# Altium schematic sheet GPS.SchDoc
size A
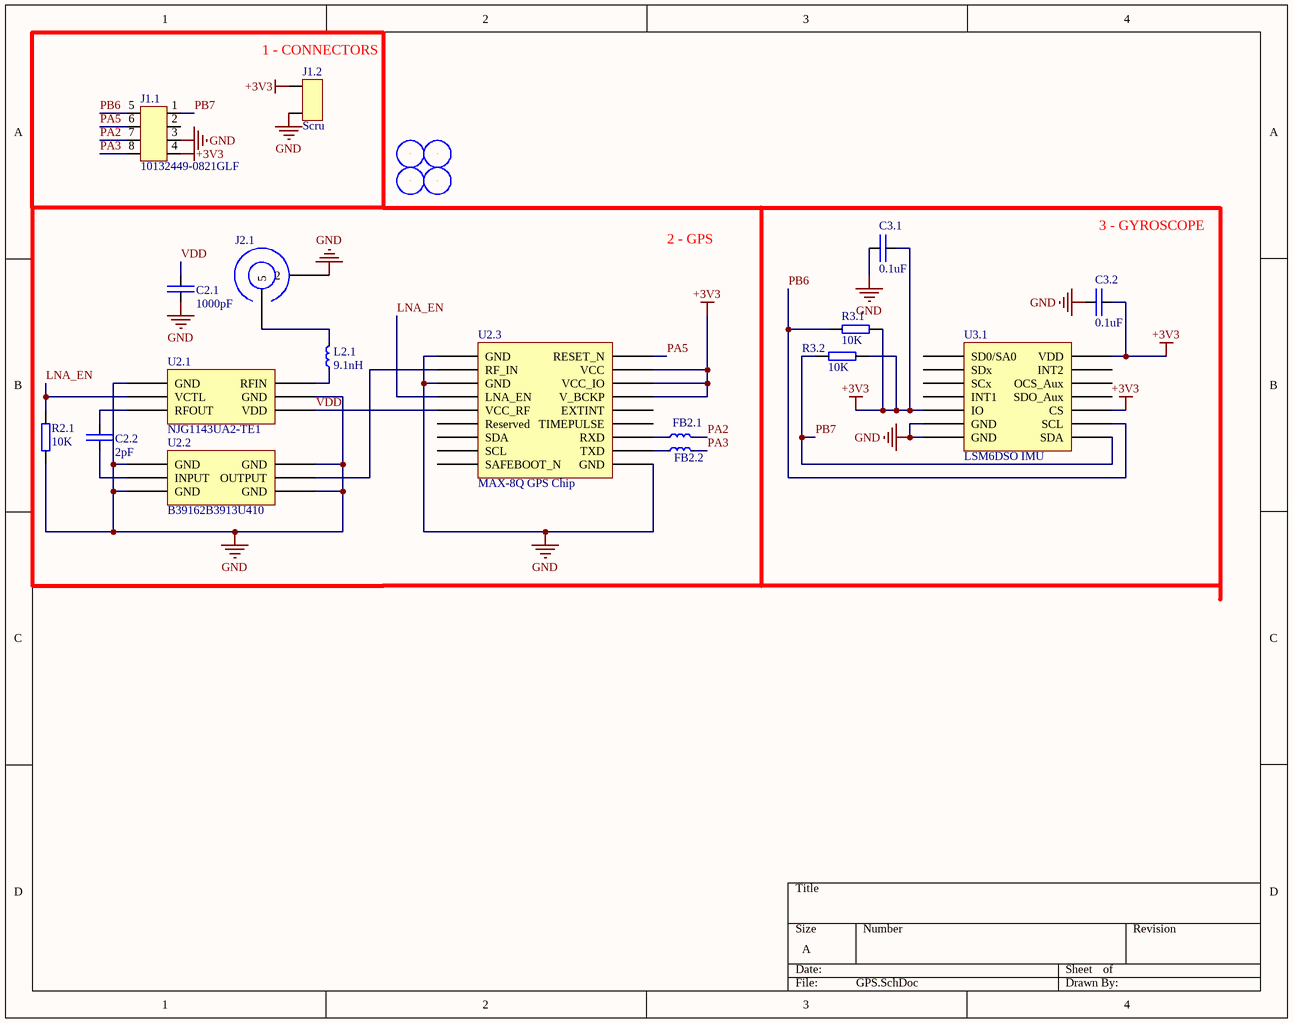
[diagram p0: GPS.SchDoc]

## Parts
(Parts that share a designator on the sheet are numbered #1, #2 ... from top to bottom, then left to right.)
?#1  3mm Mounting Hole  [3mm Mounting Hole]  (value not drawn)
?#2  3mm Mounting Hole  [3mm Mounting Hole]  (value not drawn)
?#3  3mm Mounting Hole  [3mm Mounting Hole]  (value not drawn)
?#4  3mm Mounting Hole  [3mm Mounting Hole]  (value not drawn)
C2.1  1000pF  [0805]
C2.2  2pF  [0805]
C3.1  0.1uF  [C0805]
C3.2  0.1uF  [C0805]
FB2.1  BLM15HD102SN1D  [L0402]  (value not drawn)
FB2.2  BLM15HD102SN1D  [L0402]  (value not drawn)
J1.1  10132449-0821GLF  [Micro-Fit 3.0 8pos]
J1.2  Scru  [5mm 2POS Screw terminal]
J2.1  132136  [132136]  (value not drawn)
L2.1  9.1nH  [0402]
R2.1  10K  [R0805]
R3.1  10K  [R0805]
R3.2  10K  [R0805]
U2.1  NJG1143UA2-TE1  [EPFFP6-A2]
U2.2  B39162B3913U410  [DCC6C]
U2.3  MAX-8Q GPS Chip  [MAX-8Q GPS]
U3.1  LSM6DSO IMU  [LSM6DSO IMU]

## Nets
+3V3: C3.1.2 C3.2.2 J1.1.4 J1.2.1 R3.1.2 R3.2.2 U2.3.6(V_BCKP) U2.3.7(VCC_IO) U2.3.8(VCC) U3.1.5(IO) U3.1.8(VDD) U3.1.12(CS)
GND: C2.1.1 C3.1.1 C3.2.1 J1.1.3 J1.2.2 J2.1.2 R2.1.1 U2.1.1(GND) U2.1.5(GND) U2.2.1(GND) U2.2.3(GND) U2.2.4(GND) U2.2.6(GND) U2.3.1(GND) U2.3.10(GND) U2.3.12(GND) U3.1.6(GND) U3.1.7(GND)
LNA_EN: R2.1.2 U2.1.2(VCTL) U2.3.13(LNA_EN)
PA2: FB2.1.2 J1.1.7
PA3: FB2.2.2 J1.1.8
PA5: J1.1.6 U2.3.9(RESET_N)
PB6: J1.1.5 R3.1.1 U3.1.13(SCL)
PB7: J1.1.1 R3.2.1 U3.1.14(SDA)
VDD: C2.1.2 U2.1.4(VDD) U2.3.14(VCC_RF)
NetC2.2_1: C2.2.1 U2.2.2(INPUT)
NetC2.2_2: C2.2.2 U2.1.3(RFOUT)
NetFB2.1_1: FB2.1.1 U2.3.3(RXD)
NetFB2.2_1: FB2.2.1 U2.3.2(TXD)
NetJ2.1_5: J2.1.5 L2.1.2
NetL2.1_1: L2.1.1 U2.1.6(RFIN)
NetU2.2_5: U2.2.5(OUTPUT) U2.3.11(RF_IN)

Not connected (* = marked no-connect by the designer): ?#1 1; ?#2 1; ?#3 1; ?#4 1; J1.1 2; U2.3 4(TIMEPULSE) 5(EXTINT) 15(Reserved) 16(SDA) 17(SCL) 18(SAFEBOOT_N); U3.1 1(SD0/SA0) 2(SDx) 3(SCx) 4(INT1) 9(INT2) 10(OCS_Aux) 11(SDO_Aux)

## Notes on the sheet
- (near J1.2) 1 - CONNECTORS
- 3 - GYROSCOPE
- 2 - GPS

## Library data of the parts
C2.1 = 885012007040: 1000pF ±5% 25V Ceramic Capacitor C0G, NP0 0805 (2012 Metric); ComponentLink1Description: Datasheet; ComponentLink1URL: https://katalog.we-online.de/pbs/datasheet/885012007040.pdf
C2.2 = 08055A2R0CAT2A: 2pF ±0.25pF 50V Ceramic Capacitor C0G, NP0 0805 (2012 Metric); ComponentLink1Description: Datasheet; ComponentLink1URL: http://datasheets.avx.com/C0GNP0-Dielectric.pdf
C3.1 C3.2 = CL21B104KBCWPNC: CAP CER 0.1UF 50V X7R 0805; Manufacturer: Samsung; Capacitance: 100nF; Tolerance: 10%; Supplier 1: Digi-Key; Supplier Part Number 1: 1276-6557-1-ND; Manufacturer Part Number: CL21B104KBCWPNC; Stock 1: 6545; RoHS: Yes; Mount: Surface Mount; Case/Package: 0805; Case Code (Metric): 2012; Case Code (Imperial): 0805; Min Operating Temperature: -55°C; Max Operating Temperature: 125°C; Packaging: Tape and Reel; Voltage Rating: 50V; Length: 0.079inch; Width: 0.049inch; Thickness: 0.053inch; Category: Capacitors; Pricing 1: 1 = 0.10000, 10 = 0.06700, 100 = 0.02990, 500 = 0.02138, 1000 = 0.01680 (USD); Features: Soft Termination; Ratings: AEC-Q200
FB2.1 FB2.2 = BLM15HD102SN1D: Ferrite Beads 0402 1Kohms Tape GHz Hi Spd Sig Line; Manufacturer: Taiyo Yuden; Manufacturer Part Number: NR6028T330M; Inductance: 33uH; DC Resistance (DCR): 286mR; Test Frequency: 100kHz; Max DC Current: 1.1A; Tolerance: 20%; Shielding: Shielded; Self Resonant Frequency: 10MHz; Supplier 1: Digi-Key; Supplier Part Number 1: 587-2631-1-ND; RoHS: Yes; Category: Fixed Inductors; Stock 1: 53157; Mount: Surface Mount; Case/Package: Nonstandard; Number of Pins: 2; Core Material: Ferrite; Min Operating Temperature: -25°C; Max Operating Temperature: 120°C; Composition: Wirewound; Termination: SMD/SMT; RMS Current (Irms): 1.1A; Package Quantity: 2000; Current Rating: 1.1A; Saturation Current: 1.1A; Packaging: Tape and Reel; Inductance Tolerance: 20%; Length: 0.236inch; Height: 2.8mm; Height - Seated (Max): 0.11inch; Depth: 6.2mm; Width: 0.236inch; Radiation Hardening: No; Halogen Free: Halogen Free; REACH SVHC: Unknown; ComponentLink1Description: datasheet; ComponentLink1URL: https://www.mouser.ca/datasheet/2/281/c31e-794748.pdf; ComponentLink2Description: mouser; ComponentLink2URL: https://www.mouser.ca/ProductDetail/Murata-Electronics/BLM15HD102SN1D?qs=0VEDk56ETTrhGT2kRvuD7A%3D%3D
J1.1 = 10132449-0821GLF: Micro-fit 3.0 8pos right-angle; Manufacturer: Molex; Manufacturer Part Number: 43045-0800; Number of Positions: 8; Contact Resistance: 10mR; Gender: Male; Working Voltage: 250V; Max Voltage Rating (DC): 250.25kV; Current Rating: 5A; Voltage Rating: 600V; Insulation Resistance: 1GR; Pitch: 3mm; Approvals: UL,CSA,TUV; Glow Wire Compliant: Compliant; Supplier 1: Digi-Key; Supplier Part Number 1: WM1816-ND; RoHS: Yes; Category: Headers and Wire Housings; Stock 1: 7880; Mount: Through Hole; Case/Package: SMC; Housing Color: Black; Housing Material: Thermoplastic; Contact Plating: Tin; Contact Material: Brass,Tin; Color: Black; Material: Polyester; Min Operating Temperature: -40°C; Max Operating Temperature: 105°C; Termination: Solder; Number of Contacts: 8; Orientation: Right Angle; Number of Rows: 2; Packaging: Tray; Number of Circuits: 8; Number of Poles: 8; Voltage Rating (AC): 250V; Package Quantity: 1440; Max Current Rating: 5A; Voltage Rating (DC): 250V; Diameter: 3mm; Length: 16.15mm; Height: 8.77mm; Row Spacing: 3mm; Depth: 12.2mm; Radiation Hardening: No; Flammability Rating: UL94 V-0; REACH SVHC: Unknown; Halogen Free: Low Halogen; Lead Free: Lead Free; ComponentLink1URL: https://datasheet.ciiva.com/5158/0430450800-pcb-headers-142625-5158817.pdf?src-supplier=Mouser; ComponentLink1Description: https://datasheet.ciiva.com/5158/0430450800-pcb-headers-142625-5158817.pdf?src-supplier=Mouser; ComponentLink2URL: https://datasheet.ciiva.com/7683/27645-7683683.pdf?src-supplier=Element14; ComponentLink2Description: https://datasheet.ciiva.com/7683/27645-7683683.pdf?src-supplier=Element14; ComponentLink3URL: https://datasheet.ciiva.com/11751/0900766b80027348-11751142.pdf?src-supplier=RSComponents; ComponentLink3Description: https://datasheet.ciiva.com/11751/0900766b80027348-11751142.pdf?src-supplier=RSComponents; ComponentLink4URL: https://datasheet.ciiva.com/30198/267770430450800-pcb-headers-30198875.pdf?src-supplier=Onlinecomponents.com; ComponentLink4Description: https://datasheet.ciiva.com/30198/267770430450800-pcb-headers-30198875.pdf?src-supplier=Onlinecomponents.com; ComponentLink5URL: https://datasheet.ciiva.com/19462/883536-19462164.pdf?src-supplier=Jameco; ComponentLink5Description: https://datasheet.ciiva.com/19462/883536-19462164.pdf?src-supplier=Jameco; ComponentLink6URL: https://datasheet.ciiva.com/14155/04402310-14155206.pdf?src-supplier=Distrelec; ComponentLink6Description: https://datasheet.ciiva.com/14155/04402310-14155206.pdf?src-supplier=Distrelec; ComponentLink7URL: https://datasheet.ciiva.com/16657/0430450800-pcb-headers-16657964.pdf?src-supplier=Avnet+Europe; ComponentLink7Description: https://datasheet.ciiva.com/16657/0430450800-pcb-headers-16657964.pdf?src-supplier=Avnet+Europe; ComponentLink8URL: https://datasheet.ciiva.com/10087/0430450800-pcb-headers-10087853.pdf?src-supplier=Avnet; ComponentLink8Description: https://datasheet.ciiva.com/10087/0430450800-pcb-headers-10087853.pdf?src-supplier=Avnet; ComponentLink9URL: https://datasheet.ciiva.com/1443/1850016-1443537.pdf?src-supplier=Element14; ComponentLink9Description: https://datasheet.ciiva.com/1443/1850016-1443537.pdf?src-supplier=Element14
J1.2 = 5mm 2POS Screw terminal
J2.1 = 132136: Connector, rf coaxial,SMA right angle jack for p.c. board, 4 legs, .050 cont, 50 ohm; ComponentLink1Description: Digikey; ComponentLink1URL: https://www.digikey.ca/product-detail/en/amphenol-rf-division/132136/ACX1232-ND/1011909; ComponentLink2Description: Drawing datasheet; ComponentLink2URL: https://www.amphenolrf.com/media/downloads/211/132136.PDF
L2.1 = LQP15MN9N1B02D: Fixed Inductors 9.1nH 0402; ComponentLink1Description: datasheet; ComponentLink1URL: https://www.mouser.ca/datasheet/2/281/JELF243C-0015-1623907.pdf
R2.1 R3.1 R3.2 = ERJ6ENF1002V: RES SMD 10K OHM 1% 1/8W 0805; Manufacturer: Yageo; Manufacturer Part Number: ERJ-6ENF1002V; Temperature Coefficient: 100ppm/°C; Voltage Rating (DC): 150V; Power Rating: 125mW; Resistance: 10000R; Supplier 1: Digi-Key; Supplier Part Number 1: P10.0KCCT-ND; Stock 1: 3342401; Pricing 1: 1 = 0.100000, 10 = 0.081000, 100 = 0.031100, 1000 = 0.013670, 2500 = 0.011810 (USD); RoHS: No; Mount: Surface Mount; Case/Package: 0805; Number of Pins: 2; Min Operating Temperature: -55°C; Max Operating Temperature: 155°C; Packaging: Tape and Reel; Tolerance: 1%; Length: 2mm; Height: 0.5mm; Depth: 1.25mm; Width: 1.25mm; REACH SVHC: No SVHC; Lead Free: Lead Free; ComponentLink1URL: https://datasheet.ciiva.com/27056/2078477-27056611.pdf?src-supplier=Jameco; ComponentLink1Description: https://datasheet.ciiva.com/27056/2078477-27056611.pdf?src-supplier=Jameco; Category: Resistors
U2.1 = NJG1143UA2-TE1: RF Amplifier Low Noise Amp GaAs MMIC 1.5V to 3.6V; ComponentLink1Description: mouser; ComponentLink1URL: https://www.mouser.ca/datasheet/2/294/NJG1143UA2_E-1539345.pdf
U2.2 = B39162B3913U410: SAW Filter 1588MHzFrequency 50Ohm SMD 6Pin; ComponentLink1Description: datasheet; ComponentLink1URL: https://4donline.ihs.com/images/VipMasterIC/IC/TDKC/TDKC-S-A0001073526/TDKC-S-A0001072983-1.pdf?hkey=52A5661711E402568146F3353EA87419
U2.3 = MAX-8Q GPS Chip: High sensitivity of –166 dBm for single GNSS reception; ComponentLink1Description: datasheet; ComponentLink1URL: https://www.u-blox.com/en/product/max-8-series#tab-documentation-resources
U3.1 = LSM6DSO IMU: 3D digital accelerometer and a 3D digital gyroscope; ComponentLink1Description: datasheet; ComponentLink1URL: https://www.st.com/resource/en/datasheet/lsm6dso.pdf